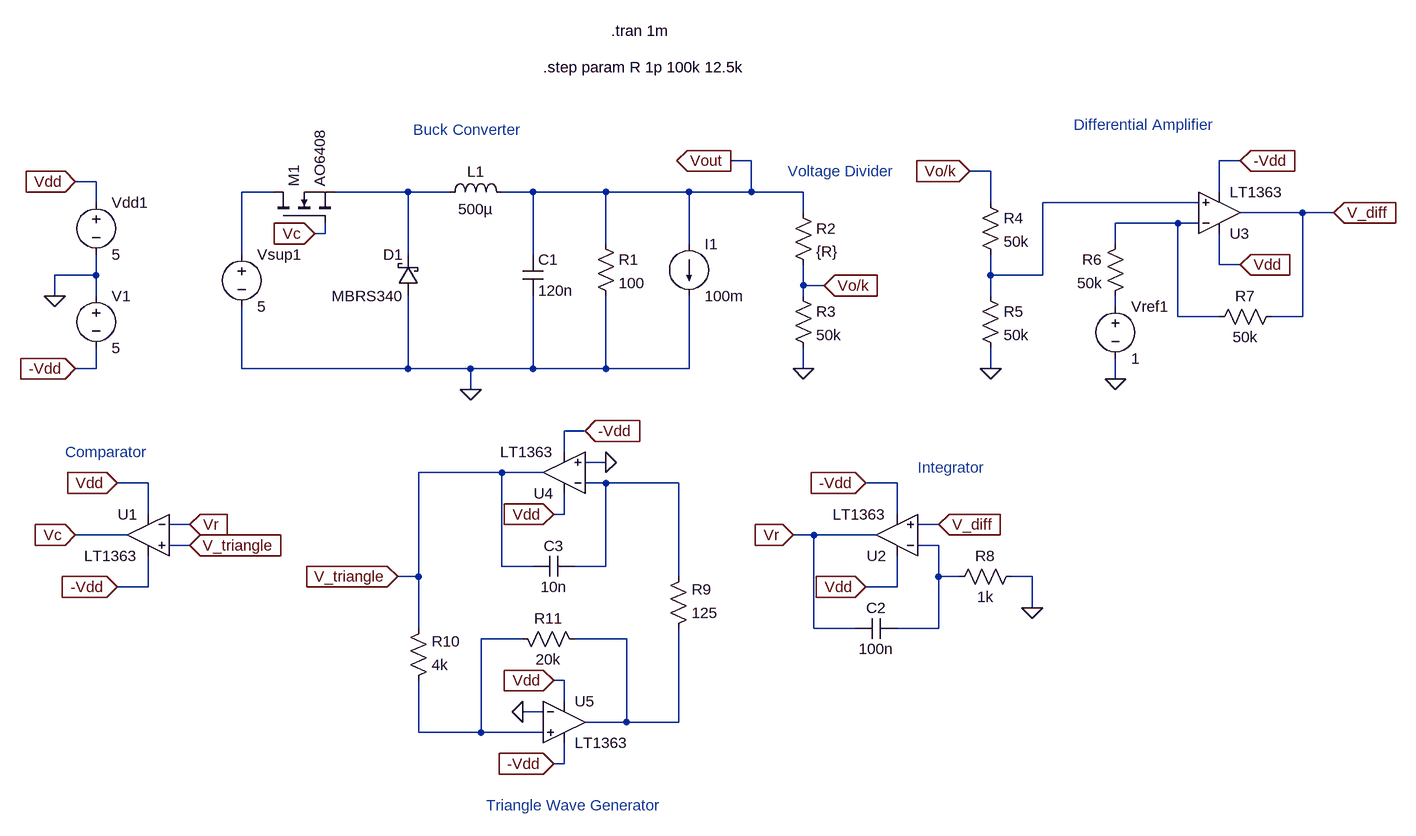
[diagram p0: schematic Q1.asc]
Q1.asc, the LTspice schematic file:
Version 4
SHEET 1 1668 1196
WIRE 288 -128 256 -128
WIRE 1040 -128 1008 -128
WIRE 656 -112 624 -112
WIRE -720 -96 -752 -96
WIRE -448 -80 -496 -80
WIRE -240 -80 -352 -80
WIRE -176 -80 -240 -80
WIRE -48 -80 -96 -80
WIRE 64 -80 -48 -80
WIRE 192 -80 64 -80
WIRE 288 -80 288 -128
WIRE 288 -80 192 -80
WIRE 368 -80 288 -80
WIRE 1008 -80 1008 -128
WIRE -720 -64 -720 -96
WIRE 656 -64 656 -112
WIRE 976 -64 736 -64
WIRE 368 -48 368 -80
WIRE 1136 -48 1040 -48
WIRE 1184 -48 1136 -48
WIRE 944 -32 848 -32
WIRE 976 -32 944 -32
WIRE -368 -16 -368 -32
WIRE -368 -16 -384 -16
WIRE 64 0 64 -80
WIRE 192 0 192 -80
WIRE 848 0 848 -32
WIRE -496 16 -496 -80
WIRE -240 16 -240 -80
WIRE -48 16 -48 -80
WIRE 1008 32 1008 -16
WIRE 1040 32 1008 32
WIRE -720 48 -720 16
WIRE -720 48 -784 48
WIRE 656 48 656 16
WIRE 736 48 736 -64
WIRE 736 48 656 48
WIRE 368 64 368 32
WIRE 400 64 368 64
WIRE -784 80 -784 48
WIRE -720 80 -720 48
WIRE 368 80 368 64
WIRE 656 80 656 48
WIRE 848 96 848 80
WIRE 944 112 944 -32
WIRE 1008 112 944 112
WIRE 1136 112 1136 -48
WIRE 1136 112 1088 112
WIRE -720 192 -720 160
WIRE -720 192 -752 192
WIRE -496 192 -496 96
WIRE -240 192 -240 80
WIRE -240 192 -496 192
WIRE -144 192 -240 192
WIRE -48 192 -48 80
WIRE -48 192 -144 192
WIRE 64 192 64 80
WIRE 64 192 -48 192
WIRE 192 192 192 80
WIRE 192 192 64 192
WIRE 368 192 368 160
WIRE 656 192 656 160
WIRE 848 208 848 176
WIRE -144 224 -144 192
WIRE 32 288 0 288
WIRE 0 320 0 288
WIRE 64 336 32 336
WIRE -96 352 -224 352
WIRE -32 352 -96 352
WIRE -640 368 -688 368
WIRE 64 368 32 368
WIRE 176 368 64 368
WIRE 512 368 464 368
WIRE -640 416 -640 368
WIRE 0 416 0 384
WIRE 0 416 -16 416
WIRE 512 416 512 368
WIRE -576 432 -608 432
WIRE 576 432 544 432
WIRE -672 448 -752 448
WIRE 384 448 352 448
WIRE 480 448 384 448
WIRE -576 464 -608 464
WIRE 576 464 544 464
WIRE -96 496 -96 352
WIRE -48 496 -96 496
WIRE 64 496 64 368
WIRE 64 496 16 496
WIRE -224 512 -224 352
WIRE -224 512 -256 512
WIRE 176 512 176 368
WIRE 576 512 576 464
WIRE 608 512 576 512
WIRE 720 512 688 512
WIRE -640 528 -640 480
WIRE -640 528 -688 528
WIRE 512 528 512 480
WIRE 512 528 464 528
WIRE 720 560 720 512
WIRE -224 592 -224 512
WIRE 384 592 384 448
WIRE 448 592 384 592
WIRE 576 592 576 512
WIRE 576 592 512 592
WIRE -64 608 -128 608
WIRE 96 608 16 608
WIRE 0 672 -16 672
WIRE 0 704 0 672
WIRE -32 720 -64 720
WIRE 96 736 96 608
WIRE 96 736 32 736
WIRE 176 736 176 592
WIRE 176 736 96 736
WIRE -224 752 -224 672
WIRE -128 752 -128 608
WIRE -128 752 -224 752
WIRE -32 752 -128 752
WIRE 0 800 0 768
WIRE 0 800 -16 800
FLAG -144 224 0
FLAG 256 -128 Vout
IOPIN 256 -128 Out
FLAG -384 -16 Vc
IOPIN -384 -16 In
FLAG -752 192 -Vdd
IOPIN -752 192 In
FLAG -752 -96 Vdd
IOPIN -752 -96 In
FLAG -784 80 0
FLAG -752 448 Vc
IOPIN -752 448 In
FLAG -688 528 -Vdd
IOPIN -688 528 In
FLAG -688 368 Vdd
IOPIN -688 368 In
FLAG -576 432 Vr
IOPIN -576 432 In
FLAG 464 368 -Vdd
IOPIN 464 368 In
FLAG 464 528 Vdd
IOPIN 464 528 In
FLAG 352 448 Vr
IOPIN 352 448 In
FLAG 368 192 0
FLAG 848 208 0
FLAG 1040 -128 -Vdd
IOPIN 1040 -128 In
FLAG 1040 32 Vdd
IOPIN 1040 32 In
FLAG 720 560 0
FLAG 400 64 Vo/k
IOPIN 400 64 In
FLAG 1184 -48 V_diff
IOPIN 1184 -48 In
FLAG 576 432 V_diff
IOPIN 576 432 In
FLAG 656 192 0
FLAG 624 -112 Vo/k
IOPIN 624 -112 In
FLAG -576 464 V_triangle
IOPIN -576 464 In
FLAG -16 416 Vdd
IOPIN -16 416 In
FLAG 32 288 -Vdd
IOPIN 32 288 In
FLAG -16 672 Vdd
IOPIN -16 672 In
FLAG -16 800 -Vdd
IOPIN -16 800 In
FLAG 64 336 0
FLAG -64 720 0
FLAG -256 512 V_triangle
IOPIN -256 512 In
SYMBOL ind -192 -64 R270
WINDOW 0 32 56 VTop 2
WINDOW 3 5 56 VBottom 2
SYMATTR InstName L1
SYMATTR Value 500µ
SYMBOL cap -64 16 R0
SYMATTR InstName C1
SYMATTR Value 120n
SYMBOL res 48 -16 R0
SYMATTR InstName R1
SYMATTR Value 100
SYMBOL current 192 0 R0
SYMATTR InstName I1
SYMATTR Value 100m
SYMBOL voltage -496 0 R0
SYMATTR InstName Vsup1
SYMATTR Value 5
SYMBOL nmos -448 -32 R270
SYMATTR InstName M1
SYMATTR Value AO6408
SYMBOL schottky -224 80 R180
WINDOW 0 24 64 Left 2
WINDOW 3 24 0 Left 2
SYMATTR InstName D1
SYMATTR Value MBRS340
SYMATTR Description Diode
SYMATTR Type diode
SYMBOL voltage -720 -80 R0
SYMATTR InstName Vdd1
SYMATTR Value 5
SYMBOL voltage -720 64 R0
SYMATTR InstName V1
SYMATTR Value 5
SYMBOL opamps/LT1363 -640 384 M0
SYMATTR InstName U1
SYMBOL opamps/LT1363 512 512 R180
SYMATTR InstName U2
SYMBOL cap 512 608 M270
WINDOW 0 32 32 VTop 2
WINDOW 3 0 32 VBottom 2
SYMATTR InstName C2
SYMATTR Value 100n
SYMBOL res 592 528 R270
WINDOW 0 32 56 VTop 2
WINDOW 3 0 56 VBottom 2
SYMATTR InstName R8
SYMATTR Value 1k
SYMBOL res 352 64 R0
SYMATTR InstName R3
SYMATTR Value 50k
SYMBOL res 352 -64 R0
SYMATTR InstName R2
SYMATTR Value {R}
SYMBOL opamps/LT1363 1008 16 M180
SYMATTR InstName U3
SYMBOL voltage 848 80 R0
SYMATTR InstName Vref1
SYMATTR Value 1
SYMBOL res 864 -16 M0
SYMATTR InstName R6
SYMATTR Value 50k
SYMBOL res 1104 96 R90
WINDOW 0 0 56 VBottom 2
WINDOW 3 32 56 VTop 2
SYMATTR InstName R7
SYMATTR Value 50k
SYMBOL res 640 -80 R0
SYMATTR InstName R4
SYMATTR Value 50k
SYMBOL res 640 64 R0
SYMATTR InstName R5
SYMATTR Value 50k
SYMBOL res 160 608 M180
WINDOW 0 36 76 Left 2
WINDOW 3 36 40 Left 2
SYMATTR InstName R9
SYMATTR Value 125
SYMBOL res -240 688 M180
WINDOW 0 36 76 Left 2
WINDOW 3 36 40 Left 2
SYMATTR InstName R10
SYMATTR Value 4k
SYMBOL res -80 592 M90
WINDOW 0 0 56 VBottom 2
WINDOW 3 32 56 VTop 2
SYMATTR InstName R11
SYMATTR Value 20k
SYMBOL cap -48 480 M90
WINDOW 0 0 32 VBottom 2
WINDOW 3 32 32 VTop 2
SYMATTR InstName C3
SYMATTR Value 10n
SYMBOL opamps/LT1363 0 416 R180
SYMATTR InstName U4
SYMBOL opamps/LT1363 0 672 R0
SYMATTR InstName U5
TEXT 72 -328 Left 2 !.tran 1m
TEXT -32 -272 Left 2 !.step param R 1p 100k 12.5k
TEXT -232 -176 Left 2 ;Buck Converter
TEXT 344 -112 Left 2 ;Voltage Divider
TEXT 784 -184 Left 2 ;Differential Amplifier
TEXT 544 344 Left 2 ;Integrator
TEXT -768 320 Left 2 ;Comparator
TEXT -120 864 Left 2 ;Triangle Wave Generator

The netlist it stands for:
* Q1.asc
L1 N002 Vout 500µ
C1 Vout 0 120n
R1 Vout 0 100
I1 Vout 0 100m
Vsup1 N001 0 5
M1 N001 Vc N002 N002 AO6408
D1 0 N002 MBRS340
Vdd1 Vdd 0 5
V1 0 -Vdd 5
XU1 V_triangle Vr Vdd -Vdd Vc LT1363  ; pins In+ In- V+ V- OUT
XU2 V_diff N007 Vdd -Vdd Vr LT1363  ; pins In+ In- V+ V- OUT
C2 N007 Vr 100n
R8 N007 0 1k
R3 Vo/k 0 50k
R2 Vout Vo/k {R}
XU3 N003 N004 Vdd -Vdd V_diff LT1363  ; pins In+ In- V+ V- OUT
Vref1 N005 0 1
R6 N004 N005 50k
R7 V_diff N004 50k
R4 Vo/k N003 50k
R5 N003 0 50k
R9 N009 N006 125
R10 N008 V_triangle 4k
R11 N008 N009 20k
C3 V_triangle N006 10n
XU4 0 N006 Vdd -Vdd V_triangle LT1363  ; pins In+ In- V+ V- OUT
XU5 N008 0 Vdd -Vdd N009 LT1363  ; pins In+ In- V+ V- OUT
.model D D
.lib standard.dio
.model NMOS NMOS
.model PMOS PMOS
.lib standard.mos
.tran 1m
.step param R 1p 100k 12.5k
* Buck Converter
* Voltage Divider
* Differential Amplifier
* Integrator
* Comparator
* Triangle Wave Generator
.lib LT1363.sub
.backanno
.end